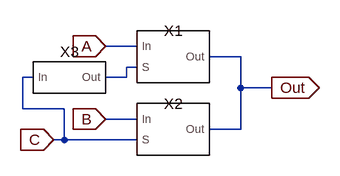
[diagram p0: schematic mux21.asc]
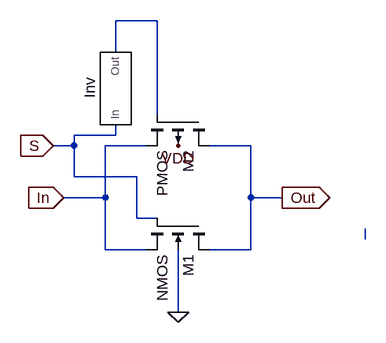
[diagram p1: sub-circuit trans_gate.asc]
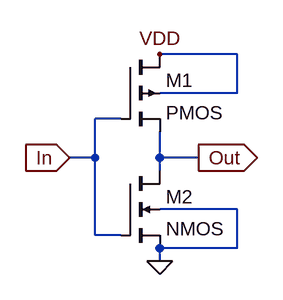
[diagram p2: sub-circuit inverter.asc]
mux21.asc, the LTspice schematic file:
Version 4
SHEET 1 880 680
WIRE 128 272 80 272
WIRE 288 288 240 288
WIRE 128 304 112 304
WIRE -32 320 -48 320
WIRE 112 320 112 304
WIRE 112 320 80 320
WIRE 288 336 288 288
WIRE 336 336 288 336
WIRE -48 368 -48 320
WIRE 16 368 -48 368
WIRE 128 384 80 384
WIRE 288 400 288 336
WIRE 288 400 240 400
WIRE 16 416 16 368
WIRE 16 416 0 416
WIRE 128 416 16 416
FLAG 80 272 A
IOPIN 80 272 In
FLAG 80 384 B
IOPIN 80 384 In
FLAG 0 416 C
IOPIN 0 416 In
FLAG 336 336 Out
IOPIN 336 336 Out
SYMBOL trans_gate 176 288 R0
WINDOW 0 8 -24 Bottom 2
SYMATTR InstName X1
SYMBOL trans_gate 176 400 R0
WINDOW 0 8 -24 Bottom 2
SYMATTR InstName X2
SYMBOL inverter 16 320 R0
SYMATTR InstName X3

trans_gate.asc, the sub-circuit schematic file:
Version 4
SHEET 1 880 680
WIRE 160 -96 96 -96
WIRE 96 -48 96 -96
WIRE 160 48 160 -96
WIRE 96 80 96 64
WIRE 96 80 32 80
WIRE 32 96 32 80
WIRE 32 96 0 96
WIRE 144 96 80 96
WIRE 304 96 240 96
WIRE 32 144 32 96
WIRE 128 144 32 144
WIRE 80 176 80 96
WIRE 80 176 16 176
WIRE 304 176 304 96
WIRE 352 176 304 176
WIRE 128 208 128 144
WIRE 160 208 128 208
WIRE 480 240 480 224
WIRE 80 256 80 176
WIRE 144 256 80 256
WIRE 304 256 304 176
WIRE 304 256 240 256
WIRE 192 352 192 256
FLAG 352 176 Out
IOPIN 352 176 Out
FLAG 192 352 0
FLAG 192 96 VDD
FLAG 16 176 In
IOPIN 16 176 In
FLAG 0 96 S
IOPIN 0 96 In
SYMBOL inverter 96 16 R270
SYMATTR InstName Inv
SYMBOL nmos4 240 208 R90
SYMATTR InstName M1
SYMBOL pmos4 240 48 R90
SYMATTR InstName M2

inverter.asc, the sub-circuit schematic file:
Version 4
SHEET 1 880 680
WIRE 320 80 224 80
WIRE 320 128 320 80
WIRE 320 128 224 128
WIRE 176 160 144 160
WIRE 144 208 144 160
WIRE 144 208 112 208
WIRE 224 208 224 176
WIRE 272 208 224 208
WIRE 224 224 224 208
WIRE 320 272 224 272
WIRE 144 304 144 208
WIRE 176 304 144 304
WIRE 320 320 320 272
WIRE 320 320 224 320
WIRE 224 336 224 320
FLAG 112 208 In
IOPIN 112 208 In
FLAG 272 208 Out
IOPIN 272 208 Out
FLAG 224 80 VDD
FLAG 224 336 0
SYMBOL pmos4 176 80 R0
SYMATTR InstName M1
SYMBOL nmos4 176 224 R0
SYMATTR InstName M2

The netlist it stands for:
* mux21.asc
XX1 A N001 Out trans_gate
XX2 B C Out trans_gate
XX3 C N001 inverter

* block symbol definitions
.subckt trans_gate In S Out
XInv S N001 inverter
M1 Out S In 0 NMOS
M2 Out N001 In VDD PMOS
.ends trans_gate

.subckt inverter In Out
M1 VDD In Out VDD PMOS
M2 Out In 0 0 NMOS
.ends inverter

.model NMOS NMOS
.model PMOS PMOS
.lib standard.mos
.backanno
.end